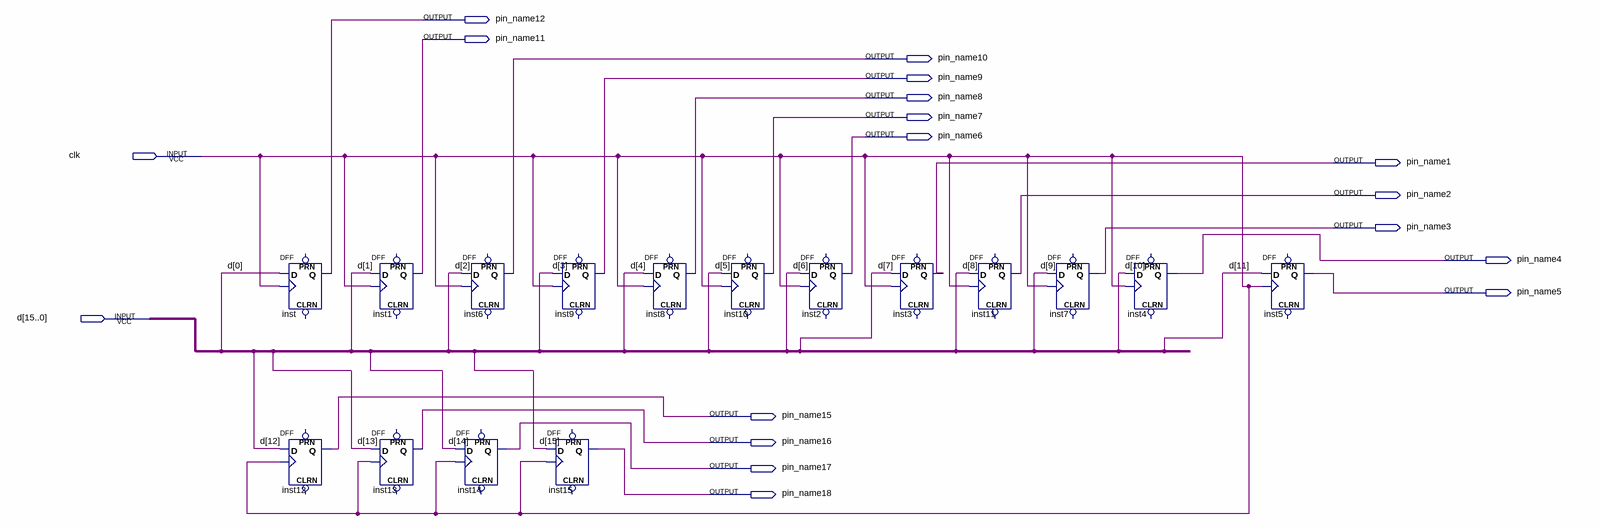
[diagram p0: schematic sheet]
// Quartus schematic Trabajo_practico_03_Entrada_in.bdf as structural Verilog: 16 symbols, 18 pins
module Trabajo_practico_03_Entrada_in (
  input  clk,
  input  [15:0] d,
  output pin_name12,
  output pin_name11,
  output pin_name10,
  output pin_name9,
  output pin_name8,
  output pin_name7,
  output pin_name6,
  output pin_name1,
  output pin_name2,
  output pin_name3,
  output pin_name4,
  output pin_name5,
  output pin_name15,
  output pin_name16,
  output pin_name17,
  output pin_name18
);

  DFF inst (.CLK(clk), .D(d[0]), .Q(pin_name12));  // open: CLRN, PRN
  DFF inst12 (.CLK(clk), .D(d[12]), .Q(pin_name15));  // open: CLRN, PRN
  DFF inst1 (.CLK(clk), .D(d[1]), .Q(pin_name11));  // open: CLRN, PRN
  DFF inst13 (.CLK(clk), .D(d[13]), .Q(pin_name16));  // open: CLRN, PRN
  DFF inst14 (.CLK(clk), .D(d[14]), .Q(pin_name17));  // open: CLRN, PRN
  DFF inst6 (.CLK(clk), .D(d[2]), .Q(pin_name10));  // open: CLRN, PRN
  DFF inst9 (.CLK(clk), .D(d[3]), .Q(pin_name9));  // open: CLRN, PRN
  DFF inst15 (.CLK(clk), .D(d[15]), .Q(pin_name18));  // open: CLRN, PRN
  DFF inst8 (.CLK(clk), .D(d[4]), .Q(pin_name8));  // open: CLRN, PRN
  DFF inst10 (.CLK(clk), .D(d[5]), .Q(pin_name7));  // open: CLRN, PRN
  DFF inst2 (.CLK(clk), .D(d[6]), .Q(pin_name6));  // open: CLRN, PRN
  DFF inst3 (.CLK(clk), .D(d[7]), .Q(pin_name1));  // open: CLRN, PRN
  DFF inst11 (.CLK(clk), .D(d[8]), .Q(pin_name2));  // open: CLRN, PRN
  DFF inst7 (.CLK(clk), .D(d[9]), .Q(pin_name3));  // open: CLRN, PRN
  DFF inst4 (.CLK(clk), .D(d[10]), .Q(pin_name4));  // open: CLRN, PRN
  DFF inst5 (.CLK(clk), .D(d[11]), .Q(pin_name5));  // open: CLRN, PRN
endmodule
